# EAGLE schematic amplifier (EAGLE 8.2.2)
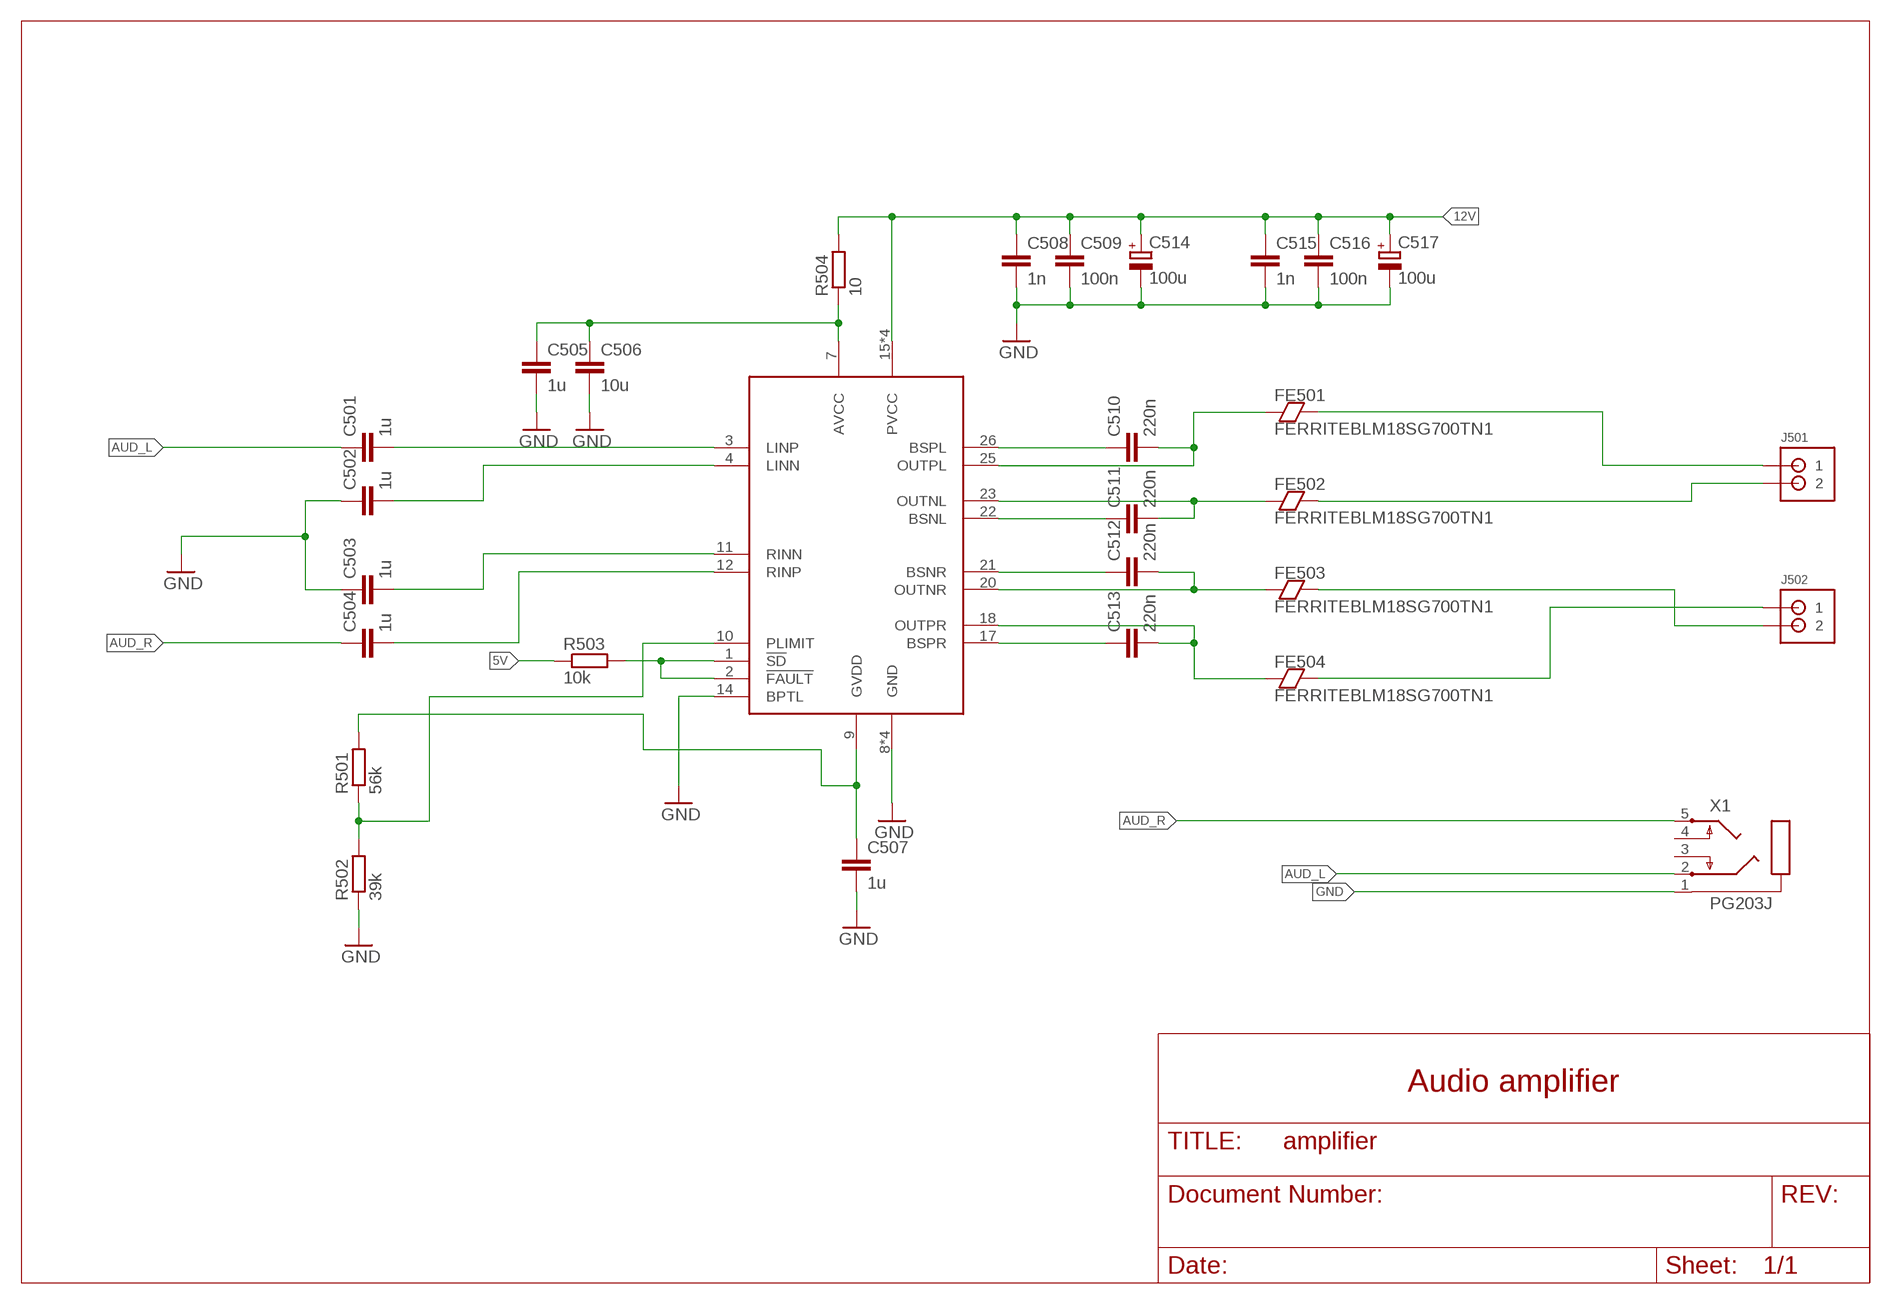
[diagram p0: schematic, sheet 1]

## Parts
C501  1u  C0603  [C0603]
C502  1u  C0603  [C0603]
C503  1u  C0603  [C0603]
C504  1u  C0603  [C0603]
C505  1u  C0603  [C0603]
C506  10u  C0603  [C0603]
C507  1u  C0603  [C0603]
C508  1n  C0603  [C0603]
C509  100n  C0603  [C0603]
C510  220n  C0603  [C0603]
C511  220n  C0603  [C0603]
C512  220n  C0603  [C0603]
C513  220n  C0603  [C0603]
C514  100u  C_POL6.6  [CAP6.6X8]
C515  1n  C0603  [C0603]
C516  100n  C0603  [C0603]
C517  100u  C_POL6.6  [CAP6.6X8]
FE501  FERRITEBLM18SG700TN1  [R0603]
FE502  FERRITEBLM18SG700TN1  [R0603]
FE503  FERRITEBLM18SG700TN1  [R0603]
FE504  FERRITEBLM18SG700TN1  [R0603]
J501  CONNECTOR-2JST-XH-2  [JST-XH-2]
J502  CONNECTOR-2JST-XH-2  [JST-XH-2]
R501  56k  R0603  [R0603]
R502  39k  R0603  [R0603]
R503  10k  R0603  [R0603]
R504  10  R0603  [R0603]
U501  TPA3136D2  [R-PDSO-G28]
X1  PG203J  [PG203J]

## Nets
5V: R503.1
12V: C508.1 C509.1 C514.1(+) C515.1 C516.1 C517.1(+) R504.2 U501.15(PVCC) U501.16(PVCC) U501.27(PVCC) U501.28(PVCC)
AUD_L: C501.1 X1.2
AUD_R: C504.1 X1.5
GND: C502.1 C503.1 C505.2 C506.2 C507.2 C508.2 C509.2 C514.2(-) C515.2 C516.2 C517.2(-) R502.1 U501.8(GND) U501.14(BPTL) U501.19(GND) U501.24(GND) U501.POWER(GND) X1.1
N$49: C501.2 U501.3(LINP)
N$50: C502.2 U501.4(LINN)
N$51: C503.2 U501.11(RINN)
N$52: C504.2 U501.12(RINP)
N$56: C512.1 U501.21(BSNR)
N$57: C513.1 U501.17(BSPR)
N$58: C511.1 U501.22(BSNL)
N$59: C510.1 U501.26(BSPL)
N$60: C510.2 FE501.1 U501.25(OUTPL)
N$61: C511.2 FE502.1 U501.23(OUTNL)
N$62: C512.2 FE503.1 U501.20(OUTNR)
N$63: C513.2 FE504.1 U501.18(OUTPR)
N$64: FE502.2 J501.P2
N$65: FE501.2 J501.P1
N$66: FE503.2 J502.P2
N$67: FE504.2 J502.P1
N$68: C507.1 R501.2 U501.9(GVDD)
N$69: R503.2 U501.1(!SD) U501.2(!FAULT)
N$70: C505.1 C506.1 R504.1 U501.7(AVCC)
N$71: R501.1 R502.2 U501.10(PLIMIT)
Unconnected: X1.3 X1.4

## Notes on the sheet
- Audio amplifier

## Library data of the parts
C501-C513 C515 C516 = Lib1:C: Capacitor SMD
C514 C517 = Lib1:C_POL: Cap polarized SMD
FE501-FE504 = Lib1:FERRITE; MPN: BLM18SG700TN1D; PROD: MURATA
J501 J502 = Lib1:CONNECTOR-2: 2-pin JST PH Shrouded Header, top entry P/N B2B-PH-K-S Mating connector PHR-2 Mating cable assembly: Sparkfun PRT-09914 <http://www.sparkfun.com/products/9914>; MPN: B2B-XH-A (LF)(SN)
R501-R504 = Lib1:R: Resistor SMD
U501 = Lib2:TPA3136D2
X1 = con-hirschmann:PG203J: MIC/HEADPHONE JACK KS-S stereo microphone/headphone jack PG203JN (Schukat); OC_FARNELL: unknown; OC_NEWARK: unknown